# EAGLE design ext (EAGLE 9.6.1)

## Sheet 1 of 2
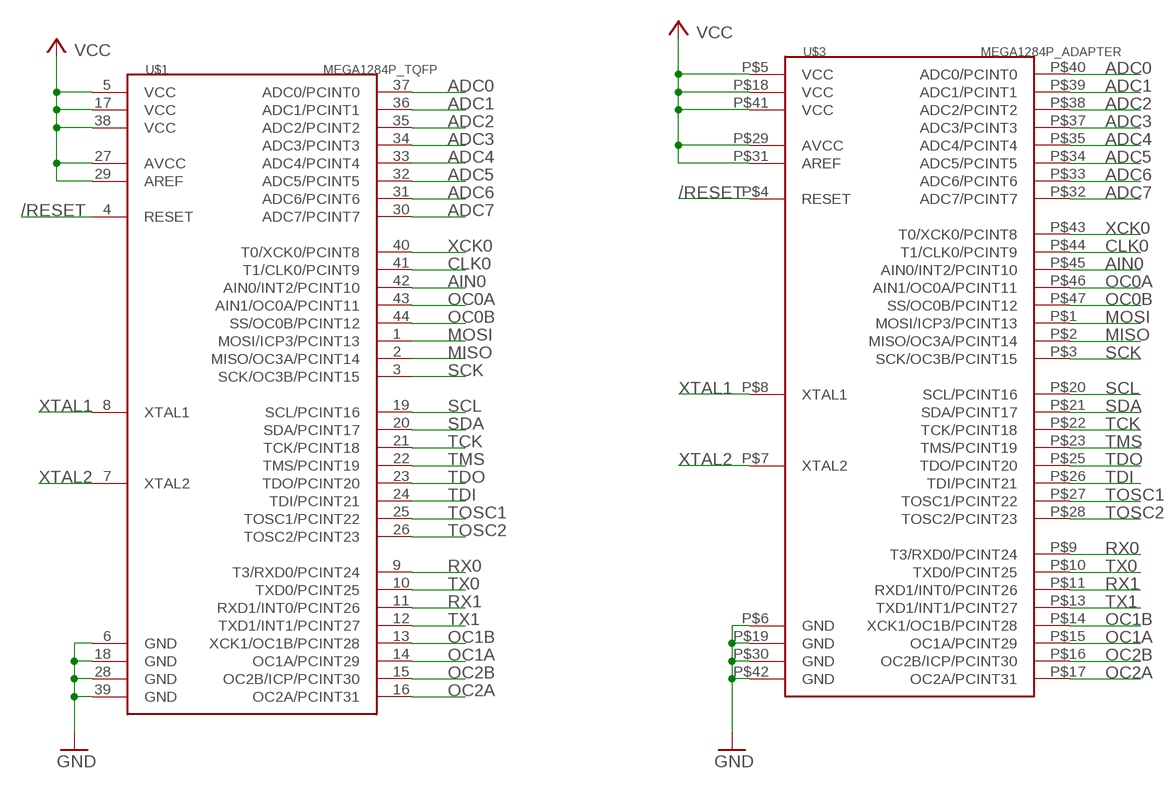
[diagram p0: schematic, sheet 1]

### Parts
U$1  MEGA1284P_TQFP  [TQFP44]
U$3  MEGA1284P_ADAPTER  [TQFP44-ADAPTER]

### Nets
/RESET: U$1.4(RESET) U$3.P$4(RESET)
ADC0: U$1.37(ADC0/PCINT0) U$3.P$40(ADC0/PCINT0)
ADC1: U$1.36(ADC1/PCINT1) U$3.P$39(ADC1/PCINT1)
ADC2: U$1.35(ADC2/PCINT2) U$3.P$38(ADC2/PCINT2)
ADC3: U$1.34(ADC3/PCINT3) U$3.P$37(ADC3/PCINT3)
ADC4: U$1.33(ADC4/PCINT4) U$3.P$35(ADC4/PCINT4)
ADC5: U$1.32(ADC5/PCINT5) U$3.P$34(ADC5/PCINT5)
ADC6: U$1.31(ADC6/PCINT6) U$3.P$33(ADC6/PCINT6)
ADC7: U$1.30(ADC7/PCINT7) U$3.P$32(ADC7/PCINT7)
AIN0: U$1.42(AIN0/INT2/PCINT10) U$3.P$45(AIN0/INT2/PCINT10)
CLK0: U$1.41(T1/CLK0/PCINT9) U$3.P$44(T1/CLK0/PCINT9)
GND: U$1.6(GND) U$1.18(GND) U$1.28(GND) U$1.39(GND) U$3.P$6(GND) U$3.P$19(GND) U$3.P$30(GND) U$3.P$42(GND)
MISO: U$1.2(MISO/OC3A/PCINT14) U$3.P$2(MISO/OC3A/PCINT14)
MOSI: U$1.1(MOSI/ICP3/PCINT13) U$3.P$1(MOSI/ICP3/PCINT13)
OC0A: U$1.43(AIN1/OC0A/PCINT11) U$3.P$46(AIN1/OC0A/PCINT11)
OC0B: U$1.44(SS/OC0B/PCINT12) U$3.P$47(SS/OC0B/PCINT12)
OC1A: U$1.14(OC1A/PCINT29) U$3.P$15(OC1A/PCINT29)
OC1B: U$1.13(XCK1/OC1B/PCINT28) U$3.P$14(XCK1/OC1B/PCINT28)
OC2A: U$1.16(OC2A/PCINT31) U$3.P$17(OC2A/PCINT31)
OC2B: U$1.15(OC2B/ICP/PCINT30) U$3.P$16(OC2B/ICP/PCINT30)
RX0: U$1.9(T3/RXD0/PCINT24) U$3.P$9(T3/RXD0/PCINT24)
RX1: U$1.11(RXD1/INT0/PCINT26) U$3.P$11(RXD1/INT0/PCINT26)
SCK: U$1.3(SCK/OC3B/PCINT15) U$3.P$3(SCK/OC3B/PCINT15)
SCL: U$1.19(SCL/PCINT16) U$3.P$20(SCL/PCINT16)
SDA: U$1.20(SDA/PCINT17) U$3.P$21(SDA/PCINT17)
TCK: U$1.21(TCK/PCINT18) U$3.P$22(TCK/PCINT18)
TDI: U$1.24(TDI/PCINT21) U$3.P$26(TDI/PCINT21)
TDO: U$1.23(TDO/PCINT20) U$3.P$25(TDO/PCINT20)
TMS: U$1.22(TMS/PCINT19) U$3.P$23(TMS/PCINT19)
TOSC1: U$1.25(TOSC1/PCINT22) U$3.P$27(TOSC1/PCINT22)
TOSC2: U$1.26(TOSC2/PCINT23) U$3.P$28(TOSC2/PCINT23)
TX0: U$1.10(TXD0/PCINT25) U$3.P$10(TXD0/PCINT25)
TX1: U$1.12(TXD1/INT1/PCINT27) U$3.P$13(TXD1/INT1/PCINT27)
VCC: U$1.5(VCC) U$1.17(VCC) U$1.27(AVCC) U$1.29(AREF) U$1.38(VCC) U$3.P$5(VCC) U$3.P$18(VCC) U$3.P$29(AVCC) U$3.P$31(AREF) U$3.P$41(VCC)
XCK0: U$1.40(T0/XCK0/PCINT8) U$3.P$43(T0/XCK0/PCINT8)
XTAL1: U$1.8(XTAL1) U$3.P$8(XTAL1)
XTAL2: U$1.7(XTAL2) U$3.P$7(XTAL2)

## Sheet 2 of 2

## Library data of the parts
U$1 = 1284p.rpt:MEGA1284P_TQFP
U$3 = mega1284p:MEGA1284P_ADAPTER

## Board
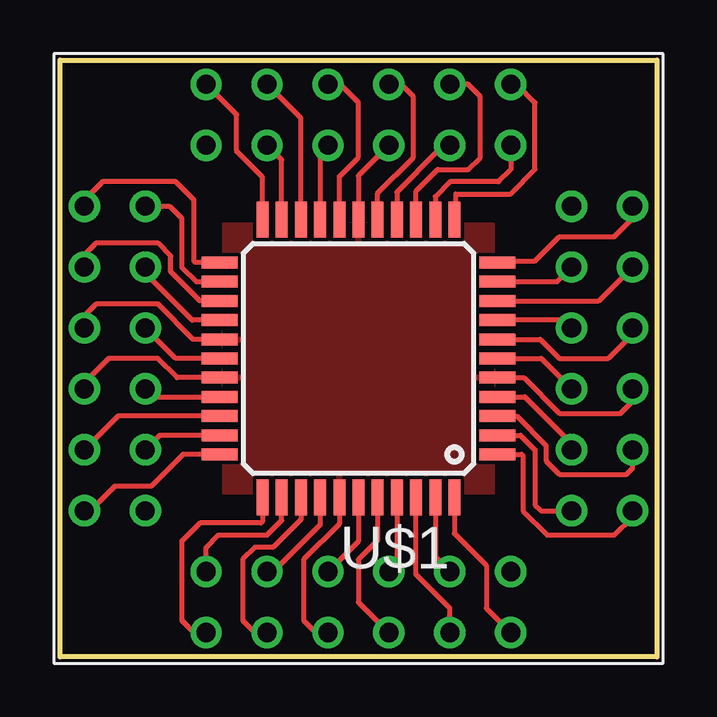
[diagram p1: board, top side]
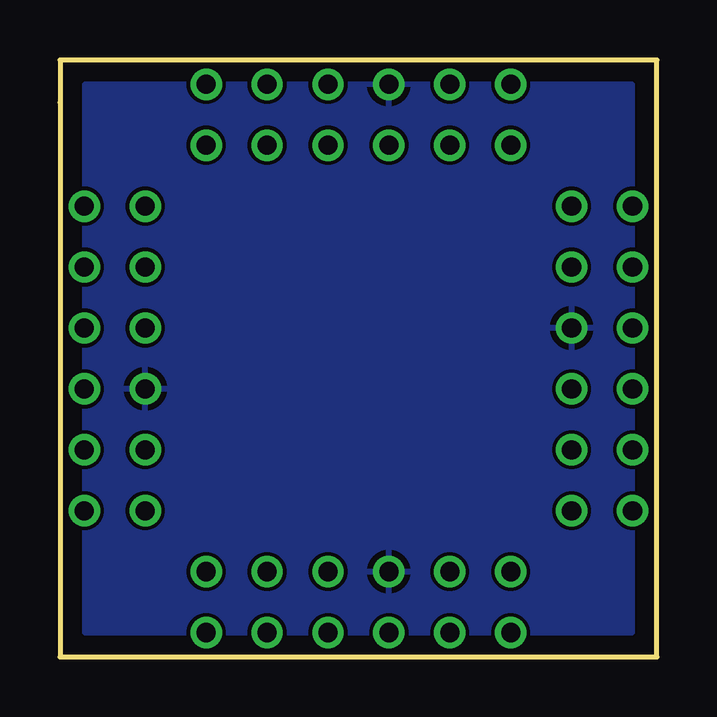
[diagram p2: board, bottom side, seen from below]

Size 24.89 x 24.89 mm. Coordinates in mm from the lower left corner, seen from the top.
Outline: 24.89,23.11 24.89,0 0,0 0,24.89 24.89,24.89 24.89,23.11
Copper layers (1*16): Top 0.035mm / dielectric 1.5mm / Bottom 0.035mm
Design rules "default *": minimum track width 6mil, minimum drill 0.35mm, track to track 6mil, track to pad 6mil, pad to pad 6mil, via to via 6mil, smd to smd 6mil, copper to edge 10mil, drill to drill 6mil, minimum pad ring 10mil, minimum via ring 8mil, stop-mask expansion 4mil, vias tented up to drill 0mil, thermal gap 10mil

### Footprints (pad centres in the part's own frame; a part is rotated, then mirrored left to right if it is on the bottom)
TQFP44 = smd 1.5 x 0.5: 1 -5.8,4; 2 -5.8,3.2; 3 -5.8,2.4; 4 -5.8,1.6; 5 -5.8,0.8; 6 -5.8,0; 7 -5.8,-0.8; 8 -5.8,-1.6; 9 -5.8,-2.4; 10 -5.8,-3.2; 11 -5.8,-4; 23 5.8,-4; 24 5.8,-3.2; 25 5.8,-2.4; 26 5.8,-1.6; 27 5.8,-0.8; 28 5.8,0; 29 5.8,0.8; 30 5.8,1.6; 31 5.8,2.4; 32 5.8,3.2; 33 5.8,4 | smd 0.5 x 1.5: 12 -4,-5.8; 13 -3.2,-5.8; 14 -2.4,-5.8; 15 -1.6,-5.8; 16 -0.8,-5.8; 17 0,-5.8; 18 0.8,-5.8; 19 1.6,-5.8; 20 2.4,-5.8; 21 3.2,-5.8; 22 4,-5.8; 34 4,5.8; 35 3.2,5.8; 36 2.4,5.8; 37 1.6,5.8; 38 0.8,5.8; 39 0,5.8; 40 -0.8,5.8; 41 -1.6,5.8; 42 -2.4,5.8; 43 -3.2,5.8; 44 -4,5.8
TQFP44-ADAPTER = drill 0.8: P$1 -6.35,2.54; P$2 -3.81,2.54; P$3 -6.35,0; P$4 -3.81,0; P$5 -6.35,-2.54; P$6 -3.81,-2.54; P$7 -6.35,-5.08; P$8 -3.81,-5.08; P$9 -6.35,-7.62; P$10 -3.81,-7.62; P$11 -6.35,-10.16; P$12 -3.81,-10.16; P$13 -1.27,-15.24; P$14 -1.27,-12.7; P$15 1.27,-15.24; P$16 1.27,-12.7; P$17 3.81,-15.24; P$18 3.81,-12.7; P$19 6.35,-15.24; P$20 6.35,-12.7; P$21 8.89,-15.24; P$22 8.89,-12.7; P$23 11.43,-15.24; P$24 11.43,-12.7; P$25 16.51,-10.16; P$26 13.97,-10.16; P$27 16.51,-7.62; P$28 13.97,-7.62; P$29 16.51,-5.08; P$30 13.97,-5.08; P$31 16.51,-2.54; P$32 13.97,-2.54; P$33 16.51,0; P$34 13.97,0; P$35 16.51,2.54; P$36 13.97,2.54; P$37 11.43,7.62; P$38 11.43,5.08; P$39 8.89,7.62; P$40 8.89,5.08; P$41 6.35,7.62; P$42 6.35,5.08; P$43 3.81,7.62; P$44 3.81,5.08; P$45 1.27,7.62; P$46 1.27,5.08; P$47 -1.27,7.62; P$48 -1.27,5.08

### Placement (x,y rotation side)
U$1  12.45,12.45 180 top
U$3  17.53,8.64 180 top

### Tracks (layer width: path | path; a pad name or v marks a point on that pad's centre or on a via)
/RESET
  Top 0.203: U$1.4 19.38,10.85 21.34,8.89 U$3.P$4
ADC0
  Top 0.203: U$1.37 10.85,5.51 8.89,3.56 U$3.P$40
ADC1
  Top 0.203: U$1.36 10.05,5.73 8.89,4.57 8.13,4.57 7.62,4.06 7.62,1.52 8.13,1.02 U$3.P$39
ADC2
  Top 0.203: U$3.P$38 6.1,4.57 6.6,5.08 8.64,5.08 9.25,5.69 U$1.35
ADC3
  Top 0.203: U$1.34 8.45,5.65 8.38,5.59 5.84,5.59 5.08,4.83 5.08,1.52 5.59,1.02 U$3.P$37
ADC4
  Top 0.203: U$3.P$35 1.27,6.1 2.29,7.11 3.81,7.11 5.14,8.45 U$1.33
ADC5
  Top 0.203: U$1.32 4.17,9.25 U$3.P$34
ADC6
  Top 0.203: U$3.P$33 2.43,10.05 U$1.31
ADC7
  Top 0.203: U$1.30 3.89,10.85 U$3.P$32
AIN0
  Top 0.203: U$1.42 14.85,3.44 16.26,2.03 U$3.P$45
CLK0
  Top 0.203: U$1.41 14.05,3.89 U$3.P$44
GND
  Top 0.203: U$3.P$42 12.45,4.83 U$1.39 | U$3.P$6 20.07,12.45 U$1.6 | U$3.P$30 4.83,12.45 U$1.28 | U$3.P$19 11.68,23.88 12.45,23.11 12.45,20.83 11.65,20.03 U$1.18
  pour Bottom: 1.02,1.02 1.02,23.88 23.88,23.88 23.88,1.02
MISO
  Top 0.203: U$1.2 19.2,9.25 19.81,8.64 19.81,6.35 20.07,6.1 U$3.P$2
MOSI
  Top 0.203: U$1.1 19.24,8.45 19.3,8.38 19.3,6.1 20.32,5.08 23.11,5.08 23.88,5.84 U$3.P$1
OC0A
  Top 0.203: U$1.43 15.65,4.17 U$3.P$46
OC0B
  Top 0.203: U$1.44 16.45,5.14 17.78,3.81 17.78,2.03 U$3.P$47
OC1A
  Top 0.203: U$1.14 14.85,19.42 15.75,20.32 17.02,20.32 17.53,20.83 17.53,23.37 17.02,23.88 U$3.P$15
OC1B
  Top 0.203: U$3.P$14 18.8,20.32 18.29,19.81 16.26,19.81 15.65,19.2 U$1.13
OC2A
  Top 0.203: U$1.16 13.25,19.34 14.73,20.83 14.73,23.37 14.22,23.88 U$3.P$17
OC2B
  Top 0.203: U$3.P$16 16,21.08 15.75,21.08 14.05,19.38 U$1.15
RX0
  Top 0.203: U$1.9 22.47,14.85 U$3.P$9
RX1
  Top 0.203: U$1.11 18.31,16.51 19.81,16.51 20.83,17.53 23.11,17.53 23.88,18.29 U$3.P$11
SCK
  Top 0.203: U$1.3 19.05,10.05 20.27,8.83 20.27,8.18 20.83,7.62 23.62,7.62 23.88,7.87 U$3.P$3
SCL
  Top 0.203: U$3.P$20 10.85,21.01 U$1.19
SDA
  Top 0.203: U$1.20 10.05,22.47 U$3.P$21
TCK
  Top 0.203: U$1.21 9.25,20.73 U$3.P$22
TDI
  Top 0.203: U$3.P$26 4.57,18.8 5.08,18.29 5.08,16.26 5.69,15.65 U$1.24
TDO
  Top 0.203: U$1.23 5.65,16.45 5.59,16.51 5.59,19.05 4.83,19.81 1.78,19.81 1.02,19.05 U$3.P$25
TMS
  Top 0.203: U$3.P$23 7.37,22.61 7.37,21.08 8.45,20 U$1.22
TOSC1
  Top 0.203: U$1.25 5.84,14.85 4.62,16.07 4.62,16.71 4.06,17.27 1.52,17.27 1.02,16.76 U$3.P$27
TOSC2
  Top 0.203: U$1.26 5.51,14.05 3.56,16 U$3.P$28
TX0
  Top 0.203: U$1.10 20.73,15.65 U$3.P$10
TX1
  Top 0.203: U$1.12 16.51,18.31 16.51,19.3 18.8,19.3 19.81,20.32 19.81,23.11 19.05,23.88 U$3.P$13
VCC
  Top 0.203: U$3.P$18 12.45,20.07 U$1.17 | U$1.29 4.88,11.65 4.08,12.45 2.03,12.45 1.02,11.43 U$3.P$31 | U$1.38 11.65,5.55 10.16,4.06 10.16,1.52 10.67,1.02 U$3.P$41 | U$1.5 19.34,11.65 20.83,10.16 23.37,10.16 23.88,10.67 U$3.P$5 | U$1.27 5.55,13.25 4.06,14.73 1.52,14.73 1.02,14.22 U$3.P$29
  pour Top: 6.86,18.03 18.03,18.03 18.03,6.86 6.86,6.86
XCK0
  Top 0.203: U$3.P$43 12.45,2.29 12.45,4.06 13.25,4.86 U$1.40
XTAL1
  Top 0.203: U$3.P$8 21.01,14.05 U$1.8
XTAL2
  Top 0.203: U$1.7 20.03,13.25 20.83,12.45 22.86,12.45 23.88,13.46 U$3.P$7